# Altium schematic sheet ISP.SchDoc
size A4; Organization: Altium Limited; Address1: L3, 12a Rodborough Rd; Address2: Frenchs Forest; Address3: NSW; Address4: Australia 2086
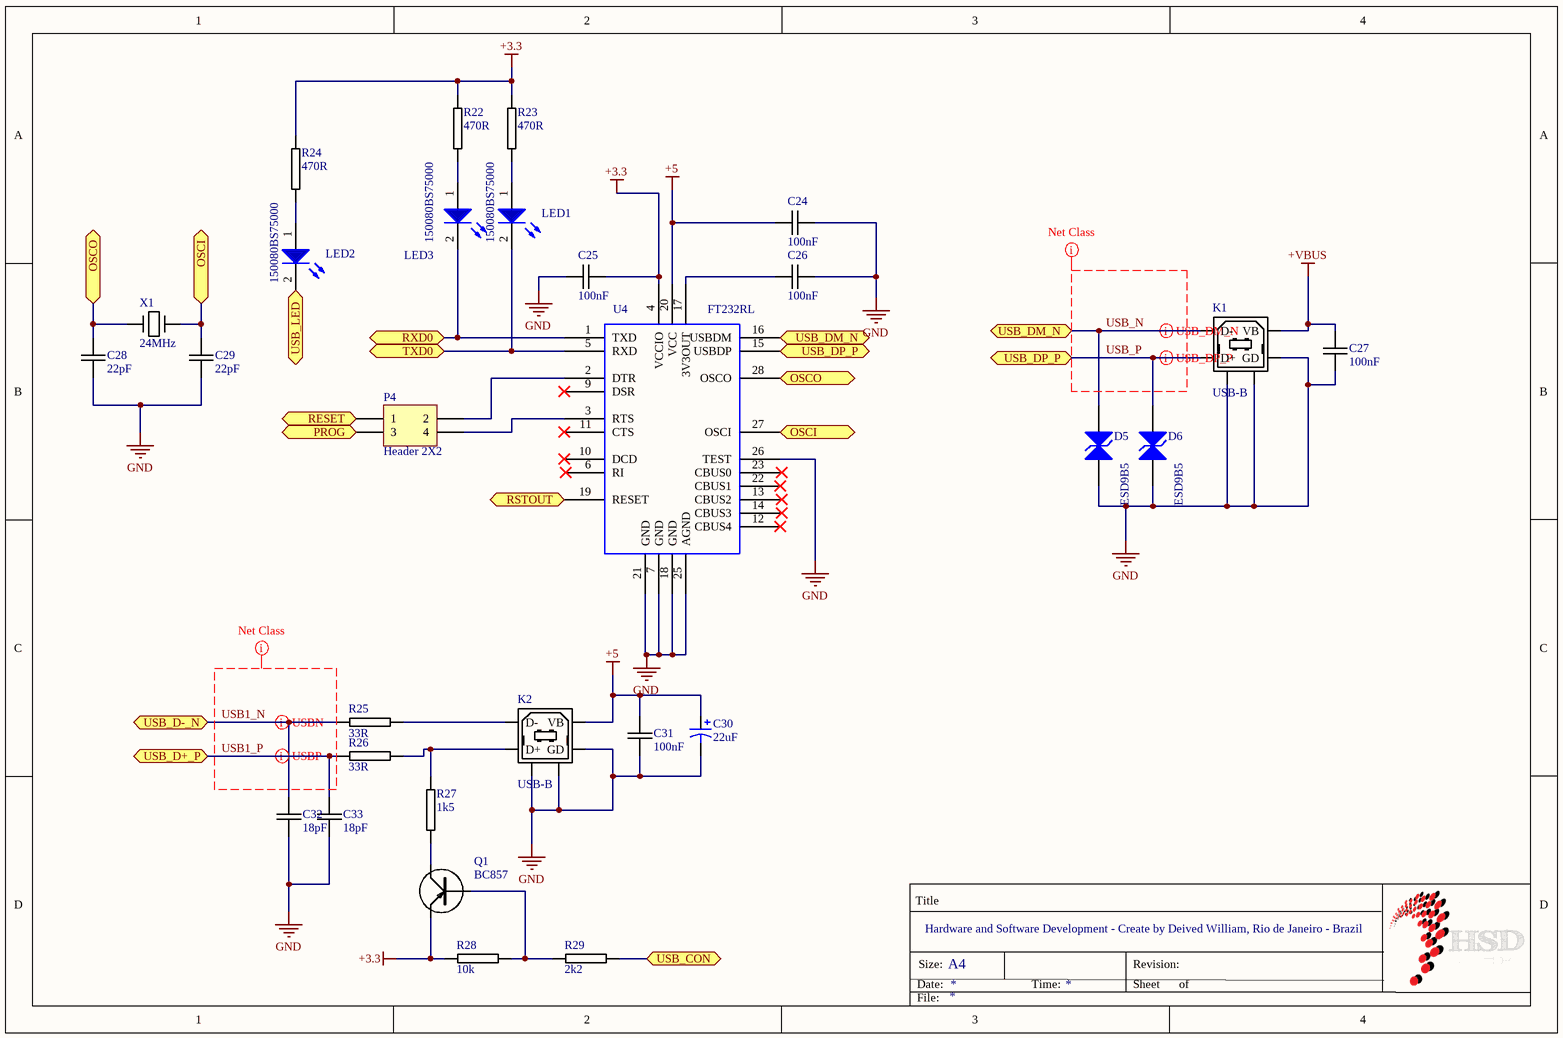
[diagram p0: ISP.SchDoc]

## Parts
C24  100nF  [0603C-GENERIC]
C25  100nF  [0603C-GENERIC]
C26  100nF  [0603C-GENERIC]
C27  100nF  [0603C-GENERIC]
C28  22pF  [0603C-GENERIC]
C29  22pF  [0603C-GENERIC]
C30  22uF  [D]
C31  100nF  [0603C-GENERIC]
C32  18pF  [0603C-GENERIC]
C33  18pF  [0603C-GENERIC]
D5  ESD9B5  [SOD-923]
D6  ESD9B5  [SOD-923]
K1  USB-B  [USB-B]
K2  USB-B  [USB-B]
LED1  150080BS75000  [LED_0805_Blue]
LED2  150080BS75000  [LED_0805_Blue]
LED3  150080BS75000  [LED_0805_Blue]
P4  Header 2X2  [HDR2X2]
Q1  BC857  [SOT23-BCE]
R22  470R  [0603R-1k]
R23  470R  [0603R-1k]
R24  470R  [0603R-1k]
R25  33R  [0603R-1k]
R26  33R  [0603R-1k]
R27  1k5  [0603R-1k]
R28  10k  [0603R-1k]
R29  2k2  [0603R-1k]
U4  FT232RL  [TSSOP28]
X1  24MHz  [XTAL-RU49/4]

## Ports
OSCI, OSCO, PROG, RESET, RSTOUT, RXD0, TXD0, USB_CON, USB_D+_P, USB_D-_N, USB_DM_N, USB_DP_P, USB_LED

## Nets
+3.3: C25.2 Q1.E R22.1 R23.1 R24.1 R28.2 U4.4(VCCIO)
+5: C24.2 C30.1 C31.1 K2.1(VB) U4.20(VCC)
+VBUS: C27.1 K1.1(VB)
GND: C24.1 C25.1 C26.1 C27.2 C28.2 C29.2 C30.2 C31.2 C32.2 C33.2 D5.1 D6.1 K1.4(GD) K1.5 K1.6 K2.4(GD) K2.5 K2.6 U4.7(GND) U4.18(GND) U4.21(GND) U4.25(AGND) U4.26(TEST)
OSCI: C29.1 U4.27(OSCI) X1.2 ; port OSCI
OSCO: C28.1 U4.28(OSCO) X1.1 ; port OSCO
PROG: P4.3 ; port PROG
RESET: P4.1 ; port RESET
RSTOUT: U4.19(RESET) ; port RSTOUT
RXD0: LED3.2(C) U4.1(TXD) ; port RXD0
TXD0: LED1.2(C) U4.5(RXD) ; port TXD0
USB1_N: C32.1 R25.1 ; port USB_D-_N
USB1_P: C33.1 R26.1 ; port USB_D+_P
USB_CON: R29.1 ; port USB_CON
USB_LED: LED2.2(C) ; port USB_LED
USB_N: D5.2 K1.2(D-) U4.16(USBDM) ; port USB_DM_N
USB_P: D6.2 K1.3(D+) U4.15(USBDP) ; port USB_DP_P
NetC26_2: C26.2 U4.17(3V3OUT)
NetK2_2: K2.2(D-) R25.2
NetK2_3: K2.3(D+) R26.2 R27.2
NetLED1_1: LED1.1(A) R23.2
NetLED2_1: LED2.1(A) R24.2
NetLED3_1: LED3.1(A) R22.2
NetP4_2: P4.2 U4.2(DTR)
NetP4_4: P4.4 U4.3(RTS)
NetQ1_B: Q1.B R28.1 R29.2
NetQ1_C: Q1.C R27.1

Not connected (* = marked no-connect by the designer): U4 6(RI) 9(DSR)* 10(DCD)* 11(CTS)* 12(CBUS4)* 13(CBUS2) 14(CBUS3) 22(CBUS1)* 23(CBUS0)

## Layout directives
net class Undefined: USB1_N, USB1_P, USB_N, USB_P
differential pair; rule Undefined; rule Differential Pairs Routing [Pref Gap = 10mil    Min Gap  = 10mil    Max Gap  = 10milPref Width = 15mil    Min Width  = 15mil    Max Width  = 15mil]; rule Differential Pairs Routing [Pref Gap = 0.254mm    Min Gap  = 0.254mm    Max Gap  = 0.254mmPref Width = 0.381mm    Min Width  = 0.381mm    Max Width  = 0.381mm]: USB_N
differential pair; rule Differential Pairs Routing [Pref Gap = 10mil    Min Gap  = 10mil    Max Gap  = 10milPref Width = 15mil    Min Width  = 15mil    Max Width  = 15mil]; rule Differential Pairs Routing [Pref Gap = 10mil    Min Gap  = 10mil    Max Gap  = 10milPref Width = 15mil    Min Width  = 15mil    Max Width  = 15mil]: USB_P
differential pair; rule Differential Pairs Routing [Pref Gap = 10mil    Min Gap  = 10mil    Max Gap  = 10milPref Width = 15mil    Min Width  = 15mil    Max Width  = 15mil]; : USB_D-_N; rule Differential Pairs Routing [Pref Gap = 0.254mm    Min Gap  = 0.254mm    Max Gap  = 0.254mmPref Width = 0.381mm    Min Width  = 0.381mm    Max Width  = 0.381mm]: USB1_N
differential pair; rule Differential Pairs Routing [Pref Gap = 10mil    Min Gap  = 10mil    Max Gap  = 10milPref Width = 15mil    Min Width  = 15mil    Max Width  = 15mil]; : USB_D+_P; rule Differential Pairs Routing [Pref Gap = 0.254mm    Min Gap  = 0.254mm    Max Gap  = 0.254mmPref Width = 0.381mm    Min Width  = 0.381mm    Max Width  = 0.381mm]: USB1_P

## Notes on the sheet
- Title
- Date:
- Size:
- Hardware and Software Development - Create by Deived William, Rio de Janeiro - Brazil
- A4
- Time:
- Revision:
- Sheet
- of
- File:

## Library data of the parts
C24-C26 C31-C33 = 0603C-22PF-50V-C0G-PAN: CAPACITOR 0603 CERAMIC; Manufacturer Part Number: ECJ-1VC1H220J; Manufacturer: Panasonic - ECG; Reel: C10; Tolerance: ±5%; Capacitance: 22pF; Temperature Coefficient: C0G, NP0; Voltage - Rated: 50V; Supplier 1: Digi-Key; Features: General Purpose; Lead Spacing: -; Supplier: Digi-Key; Packaging: Tape & Reel (TR); Mounting Type: Surface Mount, MLCC; RoHS: RoHS Compliant; Operating Temperature: -55°C ~ 125°C; Thickness: 0.80mm; Package / Case: 0603 (1608 metric); Category: Capacitors; Supplier Part Number 1: PCC220ACVTR-ND; Supplier Part Number: PCC220ACVTR-ND
C27 = 0603C-100NF-25V-X7R-TDK: CAPACITOR 0603 CERAMIC; Manufacturer Part Number: C1608X7R1E104K; Manufacturer: TDK Corporation; Reel: C12; Supplier 1: Digi-Key; Supplier Part Number 1: 445-1316-2-ND
C28 C29 = 0603C-22PF-50V-C0G-PAN: CAPACITOR 0603 CERAMIC; Manufacturer Part Number: ECJ-1VC1H220J; Manufacturer: Panasonic - ECG; Reel: C10; Tolerance: ±5%; Temperature Coefficient: C0G, NP0; Voltage - Rated: 50V; Supplier 1: Digi-Key; Features: General Purpose; Lead Spacing: -; Supplier: Digi-Key; Capacitance: 22pF; Packaging: Tape & Reel (TR); Mounting Type: Surface Mount, MLCC; RoHS: RoHS Compliant; Operating Temperature: -55°C ~ 125°C; Thickness: 0.80mm; Package / Case: 0603 (1608 metric); Category: Capacitors; Supplier Part Number 1: PCC220ACVTR-ND; Supplier Part Number: PCC220ACVTR-ND
C30 = CC106D004M: Conformal Coated Solid Tantalum Chip Capacitor: Standard Range, 10uF, 20% Tolerance, 4 WVDC @ -55°C to +85°C, Surge = 5V; Note: See Data Sheet for full range of components; Published: 19-Mar-2004; DatasheetDocument: 21-Mar-2002; PackageReference: D; Publisher: Altium Limited; ComponentLink1Description: Manufacturer Link; ComponentLink1URL: http://www.vishay.com/; ComponentLink2Description: Datasheet; ComponentLink2URL: http://www.vishay.com/docs/43017/ccec.pdf; Value: 10uF
D5 D6 = ESD9B5: ESD PROTECTION DIODE
K1 K2 = USB-B: USB B DEVICE CONNECTOR; Text Field1: Assmann; Text Field2: AU-Y1007; Text Field3: Digi-Key; Text Field4: AE1085-ND; Text Field5: Thru-Hole; Text Field6: 1.168; NI?: *; O?: *; Section:: *
LED1-LED3 = WL-SMCW 0805  150080BS75000: SMD mono-color Chip LED, WL-SMCW, Blue; Manufacturer: W黵th Elektronik eiSos GmbH; PartNo: 150080BS75000; ComponentLink1Description: Manufacturer; ComponentLink1URL: http://www.we-online.de; Created by: Christin Otto; Created Date: June 2013; ComponentLink2Description: Datasheet; ComponentLink2URL: http://katalog.we-online.com/led/datasheet/150080BS75000.pdf; Color: Blue
P4 = Header 2X2: Header, 2-Pin, Dual row; LatestRevisionDate: 17-Jul-2002; LatestRevisionNote: Re-released for DXP Platform.; Publisher: Altium Limited
Q1 = BC857: BC857 SMALL SIGNAL PNP BIPOLAR TRANSISTOR; Manufacturer: Diodes Inc; Manufacturer Part Number: BC857C-7-F; Vce Saturation (Max) @ Ib, Ic: 650mV @ 5mA, 100mA; Current - Collector (Ic) (Max): 100mA; Voltage - Collector Emitter Breakdown (Max): 45V; Frequency - Transition: 200MHz; Power - Max: 300mW; DC Current Gain (hFE) (Min) @ Ic, Vce: 420 @ 2mA, 5V; Current - Collector Cutoff (Max): 15nA; Supplier 1: Digi-Key; Supplier Part Number 1: BC857C-FDICT-ND; Mounting Type: Surface Mount; Packaging: Cut Tape (CT); Package / Case: SOT-23-3, TO-236-3, Micro3™, SSD3, SST3; Transistor Type: PNP; RoHS: RoHS Compliant; Supplier: Digi-Key; Supplier Part Number: BC857C-FDICT-ND; Category: Discrete Semiconductor Products
R22-R29 = 0603R-1K: GENERIC RESISTOR 0603; Manufacturer Part Number: RMCF 1/16 1K 1% R; Manufacturer: Stackpole Electronics Inc; Reel: R14; Supplier 1: Digi-Key; Supplier Part Number 1: RMCF0603FT1K00TR-ND
U4 = FT232RL: USB TO UART INTERFACE; Manufacturer: FTDI, Future Technology Devices International Ltd; Manufacturer Part Number: FT232RL R; Number of Channels: 8; Voltage: 3.3 V ~ 5.25 V; FIFO's: 256 Byte; Supplier 1: Digi-Key; Supplier Part Number 1: 768-1007-2-ND; RoHS: RoHS Compliant; Features: Serial Interface; Package / Case: 28-SSOP; Supplier: Digi-Key; Packaging: Tape & Reel (TR); Supplier Part Number: 768-1007-2-ND; Category: Integrated Circuits (ICs)
X1 = 16MC-HC49US: 16MHZ CRSYTAL HC49US; Supplier 1: Mouser; Supplier Part Number 1: 815-ABLS-16.0M-T